# Altium schematic sheet POWER.SchDoc
size B; DocumentNumber: 2; SheetNumber: 2; SheetTotal: 14; PAGE_TITLE: -
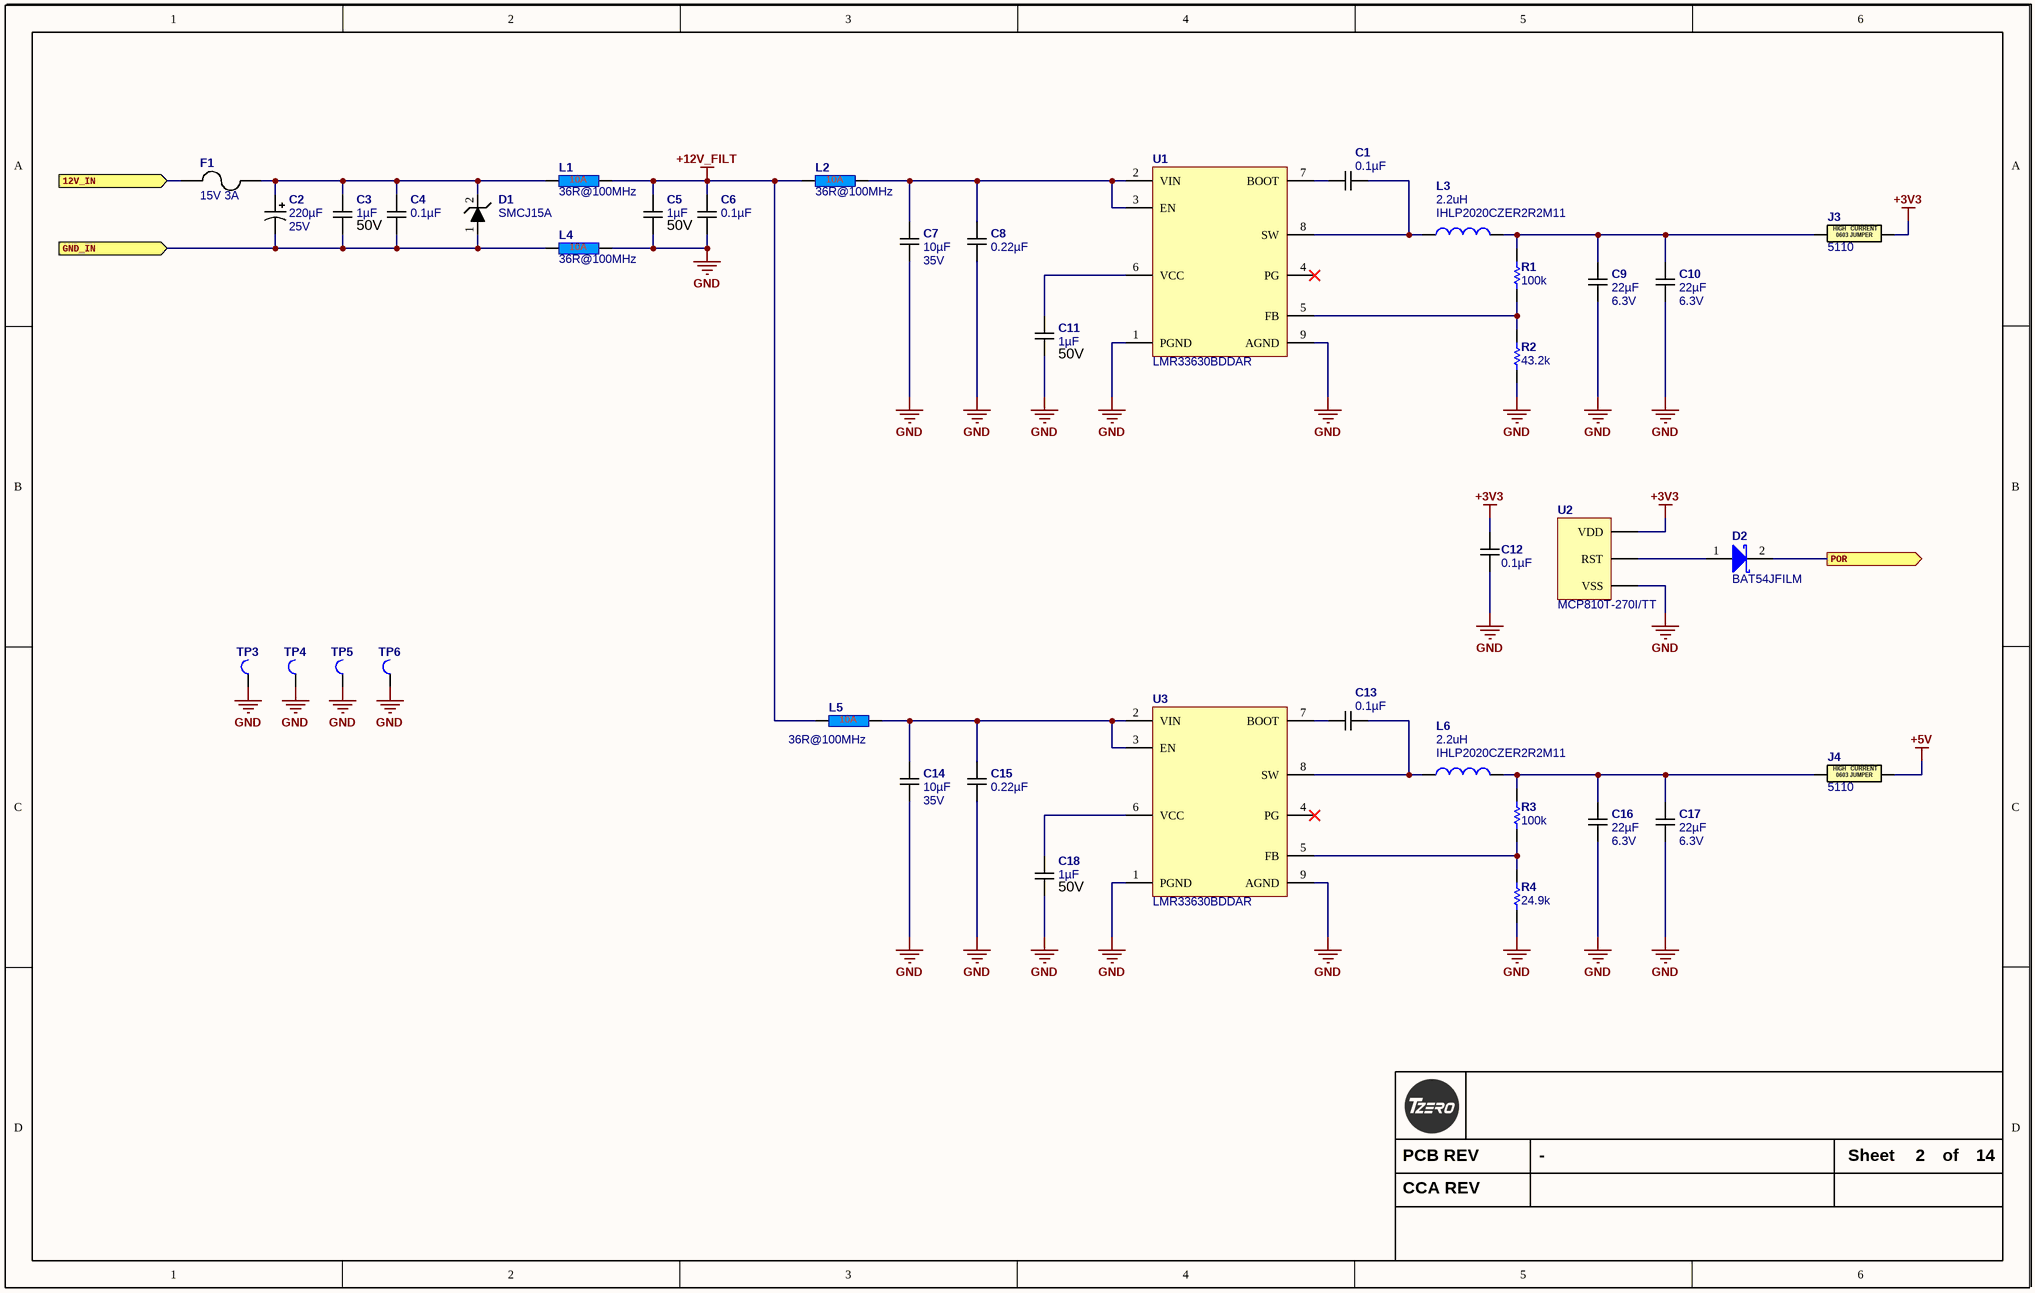
[diagram p0: POWER.SchDoc]

## Parts
C1  0.1µF  [C0402_0.55MM_HD]
C2  220µF  Voltage Rating: 25V  [C_ALU_F]
C3  1µF  Voltage - Rated: 50V  [C0805_1.50MM_MD]
C4  0.1µF  [C0402_0.55MM_HD]
C5  1µF  Voltage - Rated: 50V  [C0805_1.50MM_MD]
C6  0.1µF  [C0402_0.55MM_HD]
C7  10µF  Voltage - Rated: 35V  [C1206_1.90MM_HD]
C8  0.22µF  [C0603_0.90MM_HD]
C9  22µF  Voltage - Rated: 6.3V  [C1206_1.60MM_HD]
C10  22µF  Voltage - Rated: 6.3V  [C1206_1.60MM_HD]
C11  1µF  Voltage - Rated: 50V  [C0805_1.50MM_MD]
C12  0.1µF  [C0402_0.55MM_HD]
C13  0.1µF  [C0402_0.55MM_HD]
C14  10µF  Voltage - Rated: 35V  [C1206_1.90MM_HD]
C15  0.22µF  [C0603_0.90MM_HD]
C16  22µF  Voltage - Rated: 6.3V  [C1206_1.60MM_HD]
C17  22µF  Voltage - Rated: 6.3V  [C1206_1.60MM_HD]
C18  1µF  Voltage - Rated: 50V  [C0805_1.50MM_MD]
D1  SMCJ15A  [D_SMC_P]
D2  BAT54JFILM  [SOD-323]
F1  15V 3A  [F_PTC_2920]
J3  5110  [C0603_0.9mm]
J4  5110  [C0603_0.9mm]
L1  36R@100MHz  [T_Laird_35F0121-0SR-10]
L2  36R@100MHz  [T_Laird_35F0121-0SR-10]
L3  2.2uH  [IHLP-2020CZ]
L4  36R@100MHz  [T_Laird_35F0121-0SR-10]
L5  36R@100MHz  [T_Laird_35F0121-0SR-10]
L6  2.2uH  [IHLP-2020CZ]
R1  100k  [R0603_0.55MM_MD]
R2  43.2k  [R0603_0.55MM_MD]
R3  100k  [R0603_0.55MM_MD]
R4  24.9k  [R0603_0.55MM_MD]
TP3  PC TEST POINT MINIATURE SMT  [SMT_TEST_5015]  (value not drawn)
TP4  PC TEST POINT MINIATURE SMT  [SMT_TEST_5015]  (value not drawn)
TP5  PC TEST POINT MINIATURE SMT  [SMT_TEST_5015]  (value not drawn)
TP6  PC TEST POINT MINIATURE SMT  [SMT_TEST_5015]  (value not drawn)
U1  LMR33630BDDAR  [HSOIC-8]
U2  MCP810T-270I/TT  [SOT23_Medium]
U3  LMR33630BDDAR  [HSOIC-8]

## Ports
12V_IN (in), GND_IN (in), POR (out)

## Nets
+3V3: C12.1 J3.2 U2.3(VDD)
+5V: J4.2
+12V_FILT: C5.2 C6.2 L1.2 L2.1 L5.1
GND: C5.1 C6.1 C7.1 C8.1 C9.1 C10.1 C11.1 C12.2 C14.1 C15.1 C16.1 C17.1 C18.1 L4.2 R2.1 R4.1 TP3.1 TP4.1 TP5.1 TP6.1 U1.1(PGND) U1.9(AGND) U2.1(VSS) U3.1(PGND) U3.9(AGND)
12V_IN: F1.1 ; port 12V_IN
GND_IN: C2.2 C3.1 C4.1 D1.1(A) L4.1 ; port GND_IN
POR: D2.2(K) ; port POR
NetC1_1: C1.1 L3.1 U1.8(SW)
NetC1_2: C1.2 U1.7(BOOT)
NetC2_1: C2.1 C3.2 C4.2 D1.2(K) F1.2 L1.1
NetC7_2: C7.2 C8.2 L2.2 U1.2(VIN) U1.3(EN)
NetC9_2: C9.2 C10.2 J3.1 L3.2 R1.2
NetC11_2: C11.2 U1.6(VCC)
NetC13_1: C13.1 L6.1 U3.8(SW)
NetC13_2: C13.2 U3.7(BOOT)
NetC14_2: C14.2 C15.2 L5.2 U3.2(VIN) U3.3(EN)
NetC16_2: C16.2 C17.2 J4.1 L6.2 R3.2
NetC18_2: C18.2 U3.6(VCC)
NetD2_1: D2.1(A) U2.2(RST)
NetR1_1: R1.1 R2.2 U1.5(FB)
NetR3_1: R3.1 R4.2 U3.5(FB)

Not connected (* = marked no-connect by the designer): U1 4(PG)*; U3 4(PG)*

## Notes on the sheet
- PCB REV
- Sheet
- of
- CCA REV
- (in symbol 5110) HIGH; CURRENT; 0603 JUMPER

## Library data of the parts
C1 C4 C6 C12 C13 = CGA2B3X7R1E104K050BB: CAP CER 0.1UF 25V X7R 0402; Manufacturer: TDK Corporation; Tolerance: ±10%; Substitution Notes: 0.1µF , 25V , ±10% , X7R , -55°C ~ 125°C , AEC-Q200 , 0402; Value: 0.1µF; Temperature Coefficient: X7R; Manufacturer Part Number: CGA2B3X7R1E104K050BB; ComponentLink1Description: Datasheet (Internal); ComponentLink1URL: datasheets\TDK\mlcc_automotive_general_en.pdf; ComponentLink2Description: Datasheet (External); ComponentLink2URL: https://product.tdk.com/info/en/catalog/datasheets/mlcc_automotive_general_en.pdf; Supplier 1: Digikey; Supplier Part Number 1: 445-6902-1-ND; Category: Capacitors; Voltage - Rated: 25V; Features: -; Operating Temperature: -55°C ~ 125°C; Ratings: AEC-Q200; Package: 0402; Thickness (Max): 0.55MM
C2 = EEE-FK1E221P: CAP ALUM 220UF 25V 20% SMD; Manufacturer: Panasonic Electronic Components; Lifetime @ Temp#: 2000 Hrs @ 105°C; Ripple Current: 600mA; Impedance: 160 mOhm; Surface Mount Land Size: 0.327" L x 0.327" W (8.30mm x 8.30mm); Value_Voltage: 220µF  25V; Value: 220µF; Temperature Coefficient: Temperature Coefficient; Manufacturer Part Number: EEE-FK1E221P; ComponentLink1Description: Internal Datasheet; ComponentLink1URL: http://industrial.panasonic.com/www-cgi/jvcr13pz.cgi?E+PZ+3+ABA0120+EEEFK1E221P+7+WW; ComponentLink2Description: External Datasheet; ComponentLink2URL: http://industrial.panasonic.com/www-cgi/jvcr13pz.cgi?E+PZ+3+ABA0120+EEEFK1E221P+7+WW; Supplier 1: Digi-Key; Supplier Part Number 1: PCE3800CT-ND; Category: Capacitors; Sort Value: 220000000; Sort Value Package: F_220000000; Capacitance: 220µF; Tolerance: ±20%; Operating Temperature: -55°C ~ 105°C; Features: General Purpose; ESR (Equivalent Series Resistance): -; Mounting Type: Surface Mount; Package / Case: Radial- Can - SMD; Size / Dimension: 0.315" Dia (8.00mm); Height - Seated (Max): 0.402" (10.20mm); Lead Spacing: -; Packaging: Cut Tape (CT); Diameter: 8.00; Height: 10.20; Package: F; Ratings: AEC-Q200
C3 C5 C11 C18 = CGA4J3X7R1H105M125AE: CAP CER 1UF 50V X7R 0805; Manufacturer: TDK Corporation; Tolerance: ±20%; Substitution Notes: 1µF , 50V , ±20% , X7R , -55°C ~ 125°C , AEC-Q200 , 0805; Value: 1µF; Temperature Coefficient: X7R; Manufacturer Part Number: CGA4J3X7R1H105M125AE; ComponentLink1Description: Datasheet (Internal); ComponentLink1URL: datasheets\TDK\mlcc_automotive_general_en.pdf; ComponentLink2Description: Datasheet (External); ComponentLink2URL: https://product.tdk.com/info/en/catalog/datasheets/mlcc_automotive_general_en.pdf; Supplier 1: Digikey; Supplier Part Number 1: 445-7958-1-ND; Category: Capacitors; Features: Soft Termination; Operating Temperature: -55°C ~ 125°C; Ratings: AEC-Q200; Package: 0805; Thickness (Max): 1.50MM
C7 C14 = CGA5L1X7R1V106M160AE: CAP CER 10UF 35V X7R 1206; Manufacturer: TDK Corporation; Tolerance: ±20%; Substitution Notes: 10µF , 35V , ±20% , X7R ,  , AEC-Q200 , 1206; Value: 10µF; Temperature Coefficient: X7R; Manufacturer Part Number: CGA5L1X7R1V106M160AE; ComponentLink1Description: Datasheet (Internal); ComponentLink1URL: datasheets\TDK\mlcc_automotive_general_en.pdf; ComponentLink2Description: Datasheet (External); ComponentLink2URL: https://product.tdk.com/info/en/catalog/datasheets/mlcc_automotive_general_en.pdf; Supplier 1: Digikey; Supplier Part Number 1: 445-172484-1-ND; Category: Capacitors; Features: Soft Termination; Ratings: AEC-Q200; Package: 1206; Thickness (Max): 1.90MM
C8 C15 = CGA3E3X7R1H224K080AB: CAP CER 0.22UF 50V X7R 0603; Manufacturer: TDK Corporation; Tolerance: ±10%; Substitution Notes: 0.22µF , 50V , ±10% , X7R , -55°C ~ 125°C , AEC-Q200 , 0603; Value: 0.22µF; Temperature Coefficient: X7R; Manufacturer Part Number: CGA3E3X7R1H224K080AB; ComponentLink1Description: Datasheet (Internal); ComponentLink1URL: datasheets\TDK\mlcc_automotive_general_en.pdf; ComponentLink2Description: Datasheet (External); ComponentLink2URL: https://product.tdk.com/info/en/catalog/datasheets/mlcc_automotive_general_en.pdf; Supplier 1: Digikey; Supplier Part Number 1: 445-6926-1-ND; Category: Capacitors; Voltage - Rated: 50V; Features: -; Operating Temperature: -55°C ~ 125°C; Ratings: AEC-Q200; Package: 0603; Thickness (Max): 0.90MM
C9 C10 C16 C17 = CGA5L1X7R0J226M160AC: CAP CER 22UF 6.3V X7R 1206; Manufacturer: TDK Corporation; Tolerance: ±20%; Substitution Notes: 22µF , 6.3V , ±20% , X7R , -55°C ~ 125°C , AEC-Q200 , 1206; Value: 22µF; Temperature Coefficient: X7R; Manufacturer Part Number: CGA5L1X7R0J226M160AC; ComponentLink1Description: Datasheet (Internal); ComponentLink1URL: datasheets\TDK\mlcc_automotive_general_en.pdf; ComponentLink2Description: Datasheet (External); ComponentLink2URL: https://product.tdk.com/info/en/catalog/datasheets/mlcc_automotive_general_en.pdf; Supplier 1: Digikey; Supplier Part Number 1: 445-7884-1-ND; Category: Capacitors; Features: -; Ratings: AEC-Q200; Package: 1206; Thickness (Max): 1.60MM; Operating Temperature: -55°C ~ 125°C
D1 = SMCJ15A: DIODE TVS 15V 1500W UNI 5% SMC; Manufacturer: Littelfuse Inc; CategorySort: 850; Voltage - Breakdown: 16.7V; Polarization: Unidirectional; Diode Suffix: 1A_2C; Category: Circuit Protection; Value: SMCJ15A; Manufacturer Part Number: SMCJ15A; ComponentLink1Description: Internal Datasheet; ComponentLink1URL: http://www.littelfuse.com/data/en/Data_Sheets/Littelfuse_TVS_Diode_SMCJ.pdf; ComponentLink2Description: External Datasheet; ComponentLink2URL: http://www.littelfuse.com/data/en/Data_Sheets/Littelfuse_TVS_Diode_SMCJ.pdf; Supplier 1: Digi-Key; Supplier Part Number 1: SMCJ15ALFCT-ND; SortValue: SMCJ15A; Voltage - Reverse Standoff (Typ): 15V; Power (Watts): 1500W; Mounting Type: Surface Mount; Package: DO-214AB- SMC; Supplier Device Package: SMC; Packaging: Cut Tape (CT)
D2 = BAT54JFILM: DIODE SCHOTTKY 40V 300MA SOD323; Manufacturer: STMicroelectronics; CategorySort: 400; Reverse Recovery Time: 5ns; Peak Non-Repetitive Surge Current: 1A; Element Configuration: Single; Forward Voltage: 900mV; Packaging 1: Tape and Reel; Max Reverse Leakage Current: 1uA; Peak Reverse Current: 100uA; Polarity: Standard; Voltage Rating (DC): 30V; Capacitance: 10pF; Category: Diodes; Value: BAT54JFILM; Supplier 1: Digi-Key; Supplier Part Number 1: 497-7163-1-ND; Manufacturer Part Number: BAT54JFILM; Stock 1: 46673; Pricing 1: 1=0.36000, 10=0.29200, 100=0.11960, 500=0.09978, 1000=0.06933 (USD); RoHS: Yes; Mount: Surface Mount; Case/Package: SC; Number of Pins: 2; Weight: 0.01lb; Contact Plating: Tin,Matte; Min Operating Temperature: -40°C; Max Operating Temperature: 150°C; Forward Current: 300mA; Max Repetitive Reverse Voltage (Vrrm): 40V; Max Surge Current: 1A; Package Quantity: 1; Recovery Time: 5ns; Average Rectified Current: 300mA; Max Forward Surge Current (Ifsm): 1A; Termination: SMD/SMT; Output Current: 300mA; Current Rating: 300mA; Max Reverse Voltage (DC): 40V; Length: 1.8mm; Height: 1.07mm; Width: 1.45mm; Radiation Hardening: No; REACH SVHC: No SVHC; Lead Free: Lead Free; ComponentLink1URL: https://datasheet.ciiva.com/1177/1689724-1177952.pdf?src-supplier=Element14; ComponentLink1Description: https://datasheet.ciiva.com/1177/1689724-1177952.pdf?src-supplier=Element14; ComponentLink2URL: https://datasheet.ciiva.com/1200/1689724-1200625.pdf?src-supplier=Farnell; ComponentLink2Description: https://datasheet.ciiva.com/1200/1689724-1200625.pdf?src-supplier=Farnell; ComponentLink3URL: https://datasheet.ciiva.com/1200/cd00001322-1200626.pdf?src-supplier=Farnell; ComponentLink3Description: https://datasheet.ciiva.com/1200/cd00001322-1200626.pdf?src-supplier=Farnell; ComponentLink4URL: https://datasheet.ciiva.com/15192/getdatasheetpartid-185078-15192983.pdf?src-supplier=Verical; ComponentLink4Description: https://datasheet.ciiva.com/15192/getdatasheetpartid-185078-15192983.pdf?src-supplier=Verical; ComponentLink5URL: https://datasheet.ciiva.com/915/cd00001322-915529.pdf?src-supplier=Digi-Key; ComponentLink5Description: https://datasheet.ciiva.com/915/cd00001322-915529.pdf?src-supplier=Digi-Key; ComponentLink6URL: https://datasheet.ciiva.com/25954/cd00001322-25954459.pdf?src-supplier=Avnet+Europe; ComponentLink6Description: https://datasheet.ciiva.com/25954/cd00001322-25954459.pdf?src-supplier=Avnet+Europe; ComponentLink7URL: https://datasheet.ciiva.com/1177/1689724-1177950.pdf?src-supplier=Element14; ComponentLink7Description: https://datasheet.ciiva.com/1177/1689724-1177950.pdf?src-supplier=Element14; ComponentLink8URL: https://datasheet.ciiva.com/915/cd00001322-915527.pdf?src-supplier=Digi-Key; ComponentLink8Description: https://datasheet.ciiva.com/915/cd00001322-915527.pdf?src-supplier=Digi-Key; ComponentLink9URL: https://datasheet.ciiva.com/915/cd00001322-915528.pdf?src-supplier=Digi-Key; ComponentLink9Description: https://datasheet.ciiva.com/915/cd00001322-915528.pdf?src-supplier=Digi-Key; ComponentLink10URL: https://datasheet.ciiva.com/1177/1689724-1177951.pdf?src-supplier=Element14; ComponentLink10Description: https://datasheet.ciiva.com/1177/1689724-1177951.pdf?src-supplier=Element14; ComponentLink11URL: https://datasheet.ciiva.com/7622/1689724-7622351.pdf?src-supplier=Element14; ComponentLink11Description: https://datasheet.ciiva.com/7622/1689724-7622351.pdf?src-supplier=Element14
F1 = 2920L300/15DR: PTC RESETTABLE 15V 3A SMD 2920; Manufacturer: Littelfuse Inc; CategorySort: 850; Current - Trip (It): 5A; Current - Max: 40A; R Min/Max: 0.015 ~ 0.048 Ohm; Time to Trip: 20s; Current Trip: 3; Value: 15V 3A; Sort Value: *; Category: Circuit Protection; Manufacturer Part Number: 2920L300/15DR; ComponentLink1Description: Internal Datasheet; ComponentLink1URL: http://www.littelfuse.com/data/en/Data_Sheets/Littelfuse_PTC_2920L.pdf; ComponentLink2Description: External Datasheet; ComponentLink2URL: http://www.littelfuse.com/data/en/Data_Sheets/Littelfuse_PTC_2920L.pdf; Supplier 1: Digi-Key; Supplier Part Number 1: F2875CT-ND; SortValue: 15_3; Current - Hold (Ih) (Max): 3A; Voltage - Max: 15V; Package: 2920 (7351 Metric)- Concave; Packaging: Cut Tape (CT); Footprint: 2920
J3 J4 = 5110: 0603 Solid High Current Jumper; Manufacturer: Keystone Electronics; Resistance (Ohms): 0.0; Power (Watts): 0.5W, 1/2W; Supplier 1: Digi-Key; Supplier Part Number 1: 36-5110CT-ND; Manufacturer Part Number: 5110; RoHS: RoHS Compliant; Category: 5110; Stock 1: 23484; Pricing 1: 1=0.41, 10=0.384, 50=0.28, 100=0.2691, 250=0.24164, 500=0.23066 (USD); Packaging: Cut Tape (CT); Tolerance: Jumper; Composition: Thick Film; Features: -; Temperature Coefficient: -; Operating Temperature: -; Package / Case: 0603 (1608 Metric); Supplier Device Package: 0603; Size / Dimension: 0.061" L x 0.033" W (1.55mm x 0.85mm); Height: 0.028" (0.70mm); Number of Terminations: 2; ComponentLink1URL: http://www.keyelco.com/product-pdf.cfm?p=14038; ComponentLink1Description: http://www.keyelco.com/product-pdf.cfm?p=14038; Value: 5110
L1 L2 L4 L5 = 35F0121-0SR-10: Power Supply FB 10A; Manufacturer Name: Laird; Manufacturer: Laird Steward; Tolerance: 25%; Core Material: Ferrite; Impedance: 41R; Resistance: 42R; Number of Lines: 1; DC Resistance (DCR): 0.75mR; Test Frequency: 100MHz; Frequency: 10MHz; Rating: 10A; Manufacturer Part No.: 35F0121-0SR-10; Supplier 1: Digi-Key; Supplier Part Number 1: 240-2520-1-ND; Manufacturer Part Number: 35F0121-0SR-10; Stock: 289479; Pricing: 1 = 0.29000, 10 = 0.22600, 25 = 0.18760, 50 = 0.16160, 100 = 0.14540, 250 = 0.12280, 500 = 0.10988, 1000 = 0.09371 (USD); Mount: Surface Mount; Case/Package: SMD/SMT; Weight: 0.00512oz; Case Code (Metric): 4131; Case Code (Imperial): 1612; Min Operating Temperature: -40°C; Max Operating Temperature: 125°C; Package Quantity: 2500; Packaging: Tape and Reel; Max Current Rating: 10A; Max DC Current: 10A; Termination: SMD/SMT; Length: 0.16inch; Height: 0.12inch; Width: 0.12inch; Depth: 3.05mm; Lead Free: Lead Free; ComponentLink1URL: http://lairdtech.thomasnet.com/Asset/35F0121-0SR-10-C-2-VP.pdf; ComponentLink1Description: http://lairdtech.thomasnet.com/Asset/35F0121-0SR-10-C-2-VP.pdf; ComponentLink2URL: http://datasheet.octopart.com/35F0121-0SR-10-Steward-datasheet-65778.pdf; ComponentLink2Description: http://datasheet.octopart.com/35F0121-0SR-10-Steward-datasheet-65778.pdf; ComponentLink3URL: http://datasheet.octopart.com/35F0121-0SR-10-Steward-datasheet-153820.pdf; ComponentLink3Description: http://datasheet.octopart.com/35F0121-0SR-10-Steward-datasheet-153820.pdf; ComponentLink4URL: http://datasheet.octopart.com/35F0121-0SR-10-Steward-datasheet-14434158.pdf; ComponentLink4Description: http://datasheet.octopart.com/35F0121-0SR-10-Steward-datasheet-14434158.pdf; Value: 36R@100MHz
L3 L6 = IHLP2020CZER2R2M11: FIXED IND 2.2UH 6.75A 25 MOHM; Manufacturer: Vishay Dale; CategorySort: 300; Core Material: Metal,Composite; Tolerance: 20%; DC Resistance (DCR): 25mR; Packaging 1: Tape and Reel; Saturation Current: 5.5A; Shielding: Shielded; Self Resonant Frequency: 41MHz; Test Frequency: 100kHz; Category: INDUCTOR; Value: 2.2uH; Supplier 1: Digi-Key; Supplier Part Number 1: 541-1236-1-ND; Manufacturer Part Number: IHLP2020CZER2R2M11; Stock 1: 63099; Pricing 1: 1=2.39000, 10=2.20800, 100=1.54560, 500=1.25120, 1000=1.14080 (USD); RoHS: Yes; Mount: Surface Mount; Case/Package: 2020; Contact Plating: Tin; Min Operating Temperature: -55°C; Max Operating Temperature: 125°C; Inductance: 2.2uH; Inductance Tolerance: 20%; Package Quantity: 2000; Current Rating: 6.75A; Max DC Current: 5.5A; Termination: SMD/SMT; RMS Current (Irms): 6.75A; Military Standard: Not; Length: 5.74mm; Height: 3mm; Depth: 5.43mm; Width: 0.204inch; Height - Seated (Max): 0.118inch; Radiation Hardening: No; REACH SVHC: Unknown; Lead Free: Lead Free; ComponentLink1URL: https://datasheet.ciiva.com/11798/0900766b8102c930-11798352.pdf?src-supplier=RSComponents; ComponentLink1Description: https://datasheet.ciiva.com/11798/0900766b8102c930-11798352.pdf?src-supplier=RSComponents; ComponentLink2URL: https://datasheet.ciiva.com/1051/lp20cz11-1051642.pdf?src-supplier=Digi-Key; ComponentLink2Description: https://datasheet.ciiva.com/1051/lp20cz11-1051642.pdf?src-supplier=Digi-Key; ComponentLink3URL: https://datasheet.ciiva.com/1051/lp20cz11-1051643.pdf?src-supplier=Digi-Key; ComponentLink3Description: https://datasheet.ciiva.com/1051/lp20cz11-1051643.pdf?src-supplier=Digi-Key; ComponentLink4URL: https://datasheet.ciiva.com/17269/lp20cz11-17269547.pdf?src-supplier=Avnet+Europe; ComponentLink4Description: https://datasheet.ciiva.com/17269/lp20cz11-17269547.pdf?src-supplier=Avnet+Europe; ComponentLink5URL: https://datasheet.ciiva.com/1051/lp20cz11-1051644.pdf?src-supplier=Digi-Key; ComponentLink5Description: https://datasheet.ciiva.com/1051/lp20cz11-1051644.pdf?src-supplier=Digi-Key; ComponentLink6URL: https://datasheet.ciiva.com/24205/lp20cz11-24205966.pdf?src-supplier=Future+Electronics; ComponentLink6Description: https://datasheet.ciiva.com/24205/lp20cz11-24205966.pdf?src-supplier=Future+Electronics; ComponentLink7URL: https://datasheet.ciiva.com/46385/480942-46385615.pdf?src-supplier=Element14; ComponentLink7Description: https://datasheet.ciiva.com/46385/480942-46385615.pdf?src-supplier=Element14
R1 R3 = ERJ-3EKF1003V: RES 100K OHM 1/10W 1% 0603 SMD; Manufacturer: Panasonic Electronic Components; Package Power: 0603  (0.1W); Power (Watts): 0.1W- 1/10W; Temperature Coefficient: ±100ppm/°C; Limiting Element Voltage: 75; Maximum Overload Voltage: 150; Maximum Working Voltage: 75.0V; Substitution Notes: 100k , ±1% , 0603 , AEC-Q200; Value: 100k; Manufacturer Part Number: ERJ-3EKF1003V; ComponentLink1Description: Internal Datasheet; ComponentLink1URL: datasheets\Panasonic Electronic Components\AOA0000CE2.pdf; ComponentLink2Description: External Datasheet; ComponentLink2URL: http://industrial.panasonic.com/www-data/pdf/AOA0000/AOA0000CE2.pdf; Supplier 1: Digi-Key; Supplier Part Number 1: P100KHCT-ND; Category: Resistors; Resistance (Ohms): 100k; Composition: Thick Film; Features: -; Tolerance: ±1%; Package: 0603 (1608 Metric); Supplier Package: 0603; Size / Dimension: 0.063" L x 0.031" W (1.60mm x 0.80mm); Height: 0.55MM; Number of Terminations: 2; Packaging: Cut Tape (CT); Sort Value: 100000; Sort Value Package: 603_100000; Ratings: AEC-Q200
R2 = ERJ-3EKF4322V: RES 43.2K OHM 1/10W 1% 0603 SMD; Manufacturer: Panasonic Electronic Components; Package Power: 0603  (0.1W); Power (Watts): 0.1W- 1/10W; Temperature Coefficient: ±100ppm/°C; Limiting Element Voltage: 75; Maximum Overload Voltage: 150; Maximum Working Voltage: 65.7V; Substitution Notes: 43.2k , ±1% , 0603 , AEC-Q200; Value: 43.2k; Manufacturer Part Number: ERJ-3EKF4322V; ComponentLink1Description: Internal Datasheet; ComponentLink1URL: datasheets\Panasonic Electronic Components\AOA0000CE2.pdf; ComponentLink2Description: External Datasheet; ComponentLink2URL: http://industrial.panasonic.com/www-data/pdf/AOA0000/AOA0000CE2.pdf; Supplier 1: Digi-Key; Supplier Part Number 1: P43.2KHCT-ND; Category: Resistors; Resistance (Ohms): 43.2k; Composition: Thick Film; Features: -; Tolerance: ±1%; Package: 0603 (1608 Metric); Supplier Package: 0603; Size / Dimension: 0.063" L x 0.031" W (1.60mm x 0.80mm); Height: 0.55MM; Number of Terminations: 2; Packaging: Cut Tape (CT); Sort Value: 43200; Sort Value Package: 603_43200; Ratings: AEC-Q200
R4 = ERJ-3EKF2492V: RES 24.9K OHM 1/10W 1% 0603 SMD; Manufacturer: Panasonic Electronic Components; Package Power: 0603  (0.1W); Power (Watts): 0.1W- 1/10W; Temperature Coefficient: ±100ppm/°C; Limiting Element Voltage: 75; Maximum Overload Voltage: 150; Maximum Working Voltage: 49.9V; Substitution Notes: 24.9k , ±1% , 0603 , AEC-Q200; Value: 24.9k; Manufacturer Part Number: ERJ-3EKF2492V; ComponentLink1Description: Internal Datasheet; ComponentLink1URL: datasheets\Panasonic Electronic Components\AOA0000CE2.pdf; ComponentLink2Description: External Datasheet; ComponentLink2URL: http://industrial.panasonic.com/www-data/pdf/AOA0000/AOA0000CE2.pdf; Supplier 1: Digi-Key; Supplier Part Number 1: P24.9KHCT-ND; Category: Resistors; Resistance (Ohms): 24.9k; Composition: Thick Film; Features: -; Tolerance: ±1%; Package: 0603 (1608 Metric); Supplier Package: 0603; Size / Dimension: 0.063" L x 0.031" W (1.60mm x 0.80mm); Height: 0.55MM; Number of Terminations: 2; Packaging: Cut Tape (CT); Sort Value: 24900; Sort Value Package: 603_24900; Ratings: AEC-Q200
TP3-TP6 = 5015: Manufacturer: Keystone Electronics; Manufacturer Part Number: 5015; ROHS Certificate: *; Value: PC TEST POINT MINIATURE SMT; Pricing: *; Supplier 1: Digi-Key; Supplier Part Number 1: 36-5015CT-ND; RoHS: RoHS Compliant; Category: Test and Measurement; Type: PC Test Point, Miniature; Terminal: 0.010" (0.25mm) Phosphor Bronze, Silver Plate; Mounting Type: Surface Mount; Material: Phosphor Bronze; Color: -; Packaging: Cut Tape (CT); ComponentLink1URL: http://mail.keyelco.com/ENG._DEPT/PDF%20CAT%20NO%20Drawings/5015.pdf; ComponentLink1Description: http://mail.keyelco.com/ENG._DEPT/PDF%20CAT%20NO%20Drawings/5015.pdf
U1 U3 = LMR33630BDDAR: SIMPLE SWITCHER® 3.8V to 36V, 3A Synchronous Buck Converter With Ultra-Low EMI 8-SO PowerPAD -40 to 125; Manufacturer: Texas Instruments; CategorySort: 600; Output Type: Adjustable; Packaging 1: Tape and Reel; Output Configuration: Positive; Number of Outputs: 1; Min Output Voltage: 1V; Max Output Voltage: 24V; Switching Frequency: 1.4MHz; Synchronous Rectifier: Yes; Category: Integrated Circuits; Value: LMR33630BDDAR; Supplier 1: Digi-Key; Supplier Part Number 1: 296-49765-1-ND; Manufacturer Part Number: LMR33630BDDAR; Stock 1: 1151; Pricing 1: 1=2.21000, 10=1.98800, 25=1.87520, 100=1.50000, 250=1.31252, 500=1.27500, 1000=1.01250 (USD); RoHS: No; Mount: Surface Mount; Number of Pins: 8; Min Operating Temperature: -40°C; Max Operating Temperature: 125°C; Min Input Voltage: 3.8V; Max Input Voltage: 36V; Output Current: 3A; ComponentLink1URL: http://www.ti.com/lit/ds/symlink/lmr33630.pdf?src-supplier=Digi-Key; ComponentLink1Description: http://www.ti.com/lit/ds/symlink/lmr33630.pdf?src-supplier=Digi-Key; ComponentLink2URL: http://www.ti.com/general/docs/suppproductinfo.tsp?distId=10&amp;gotoUrl=http%3A%2F%2Fwww.ti.com%2Flit%2Fgpn%2Flmr33630&src-supplier=Digi-Key; ComponentLink2Description: http://www.ti.com/general/docs/suppproductinfo.tsp?distId=10&amp;gotoUrl=http%3A%2F%2Fwww.ti.com%2Flit%2Fgpn%2Flmr33630&src-supplier=Digi-Key
U2 = MCP810T-270I/TT: IC SUPERVISOR 2.70V HIGH SOT23; Manufacturer: Microchip Technology; Number of Voltages Monitored: 1; Output: Push-Pull, Totem Pole; Reset: Active High; Reset Timeout: 150 ms Minimum; Voltage - Threshold: 2.625V; CategorySort: 600; Value: MCP810T-270I/TT; Sort Value: *; Category: Integrated Circuits; Supplier 1: Digi-Key; Supplier Part Number 1: MCP810T-270I/TTCT-ND; Manufacturer Part Number: MCP810T-270I/TT; RoHS: RoHS Compliant; Stock 1: 6831; Pricing 1: 1=0.54, 10=0.45, 25=0.37, 100=0.34 (USD); Type: Simple Reset/Power-On Reset; Operating Temperature: -40°C ~ 85°C; Mounting Type: Surface Mount; Package: SOT-23-3, TO-236-3, Micro3™, SSD3, SST3; Packaging: Cut Tape (CT); Supplier Device Package: *; ComponentLink1URL: http://ww1.microchip.com/downloads/en/DeviceDoc/11194c.pdf; ComponentLink1Description: http://ww1.microchip.com/downloads/en/DeviceDoc/11194c.pdf